# EasyEDA Pro project OURphone_PCB_2026-01-30.epro, board 1-PCB_PCB_OURS PHONE_CONNECTORS_FLIP_2
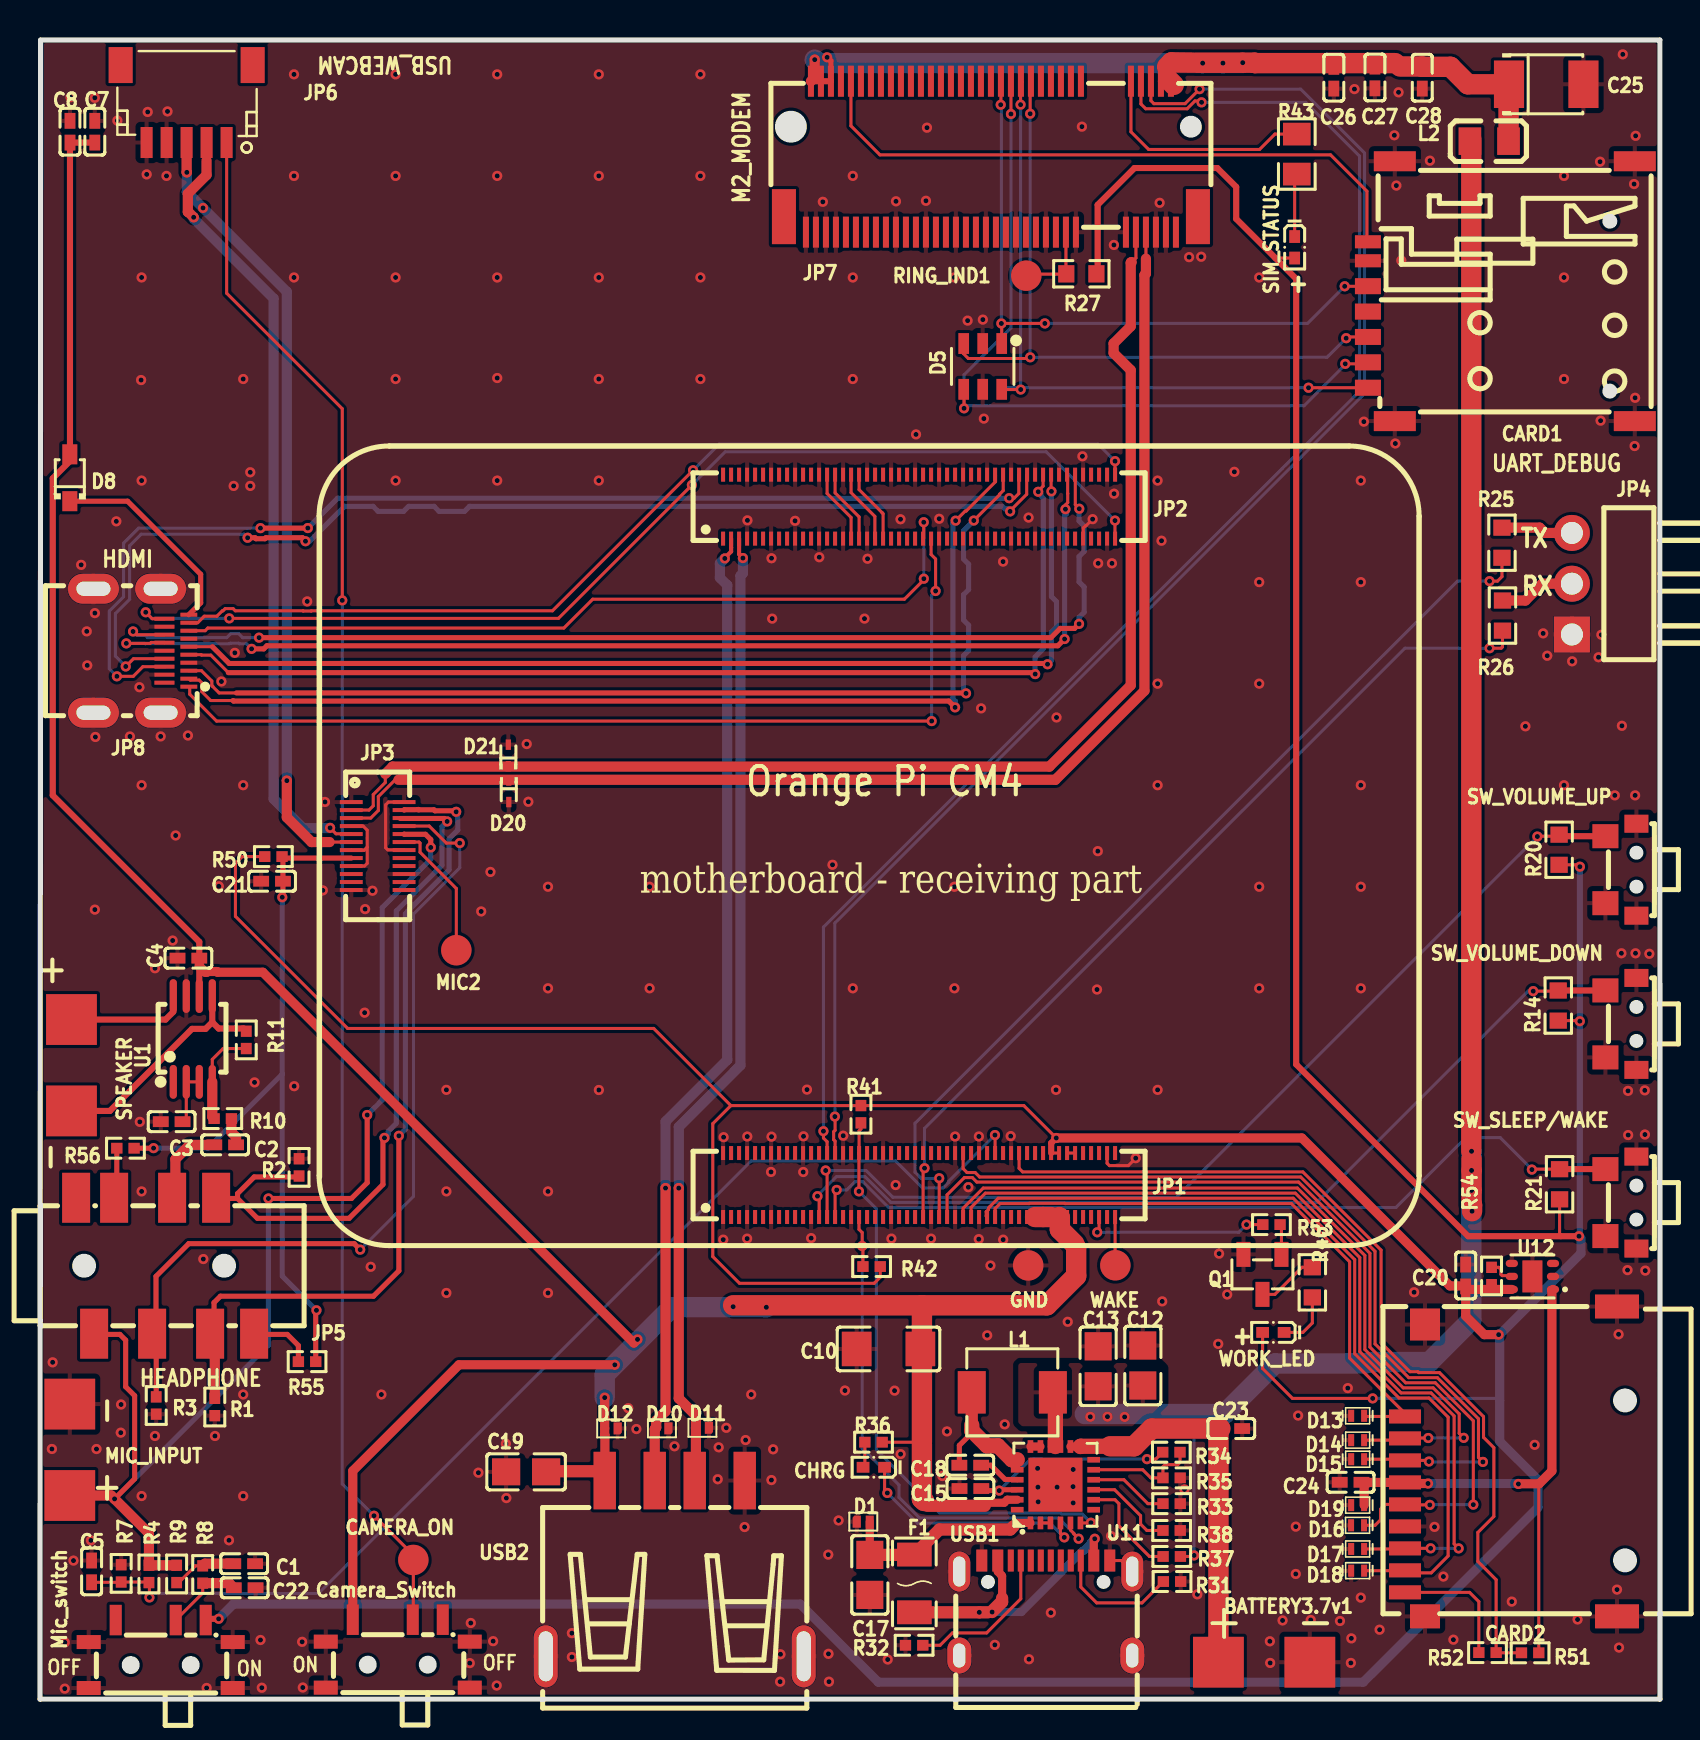
[diagram p8: board, top side]
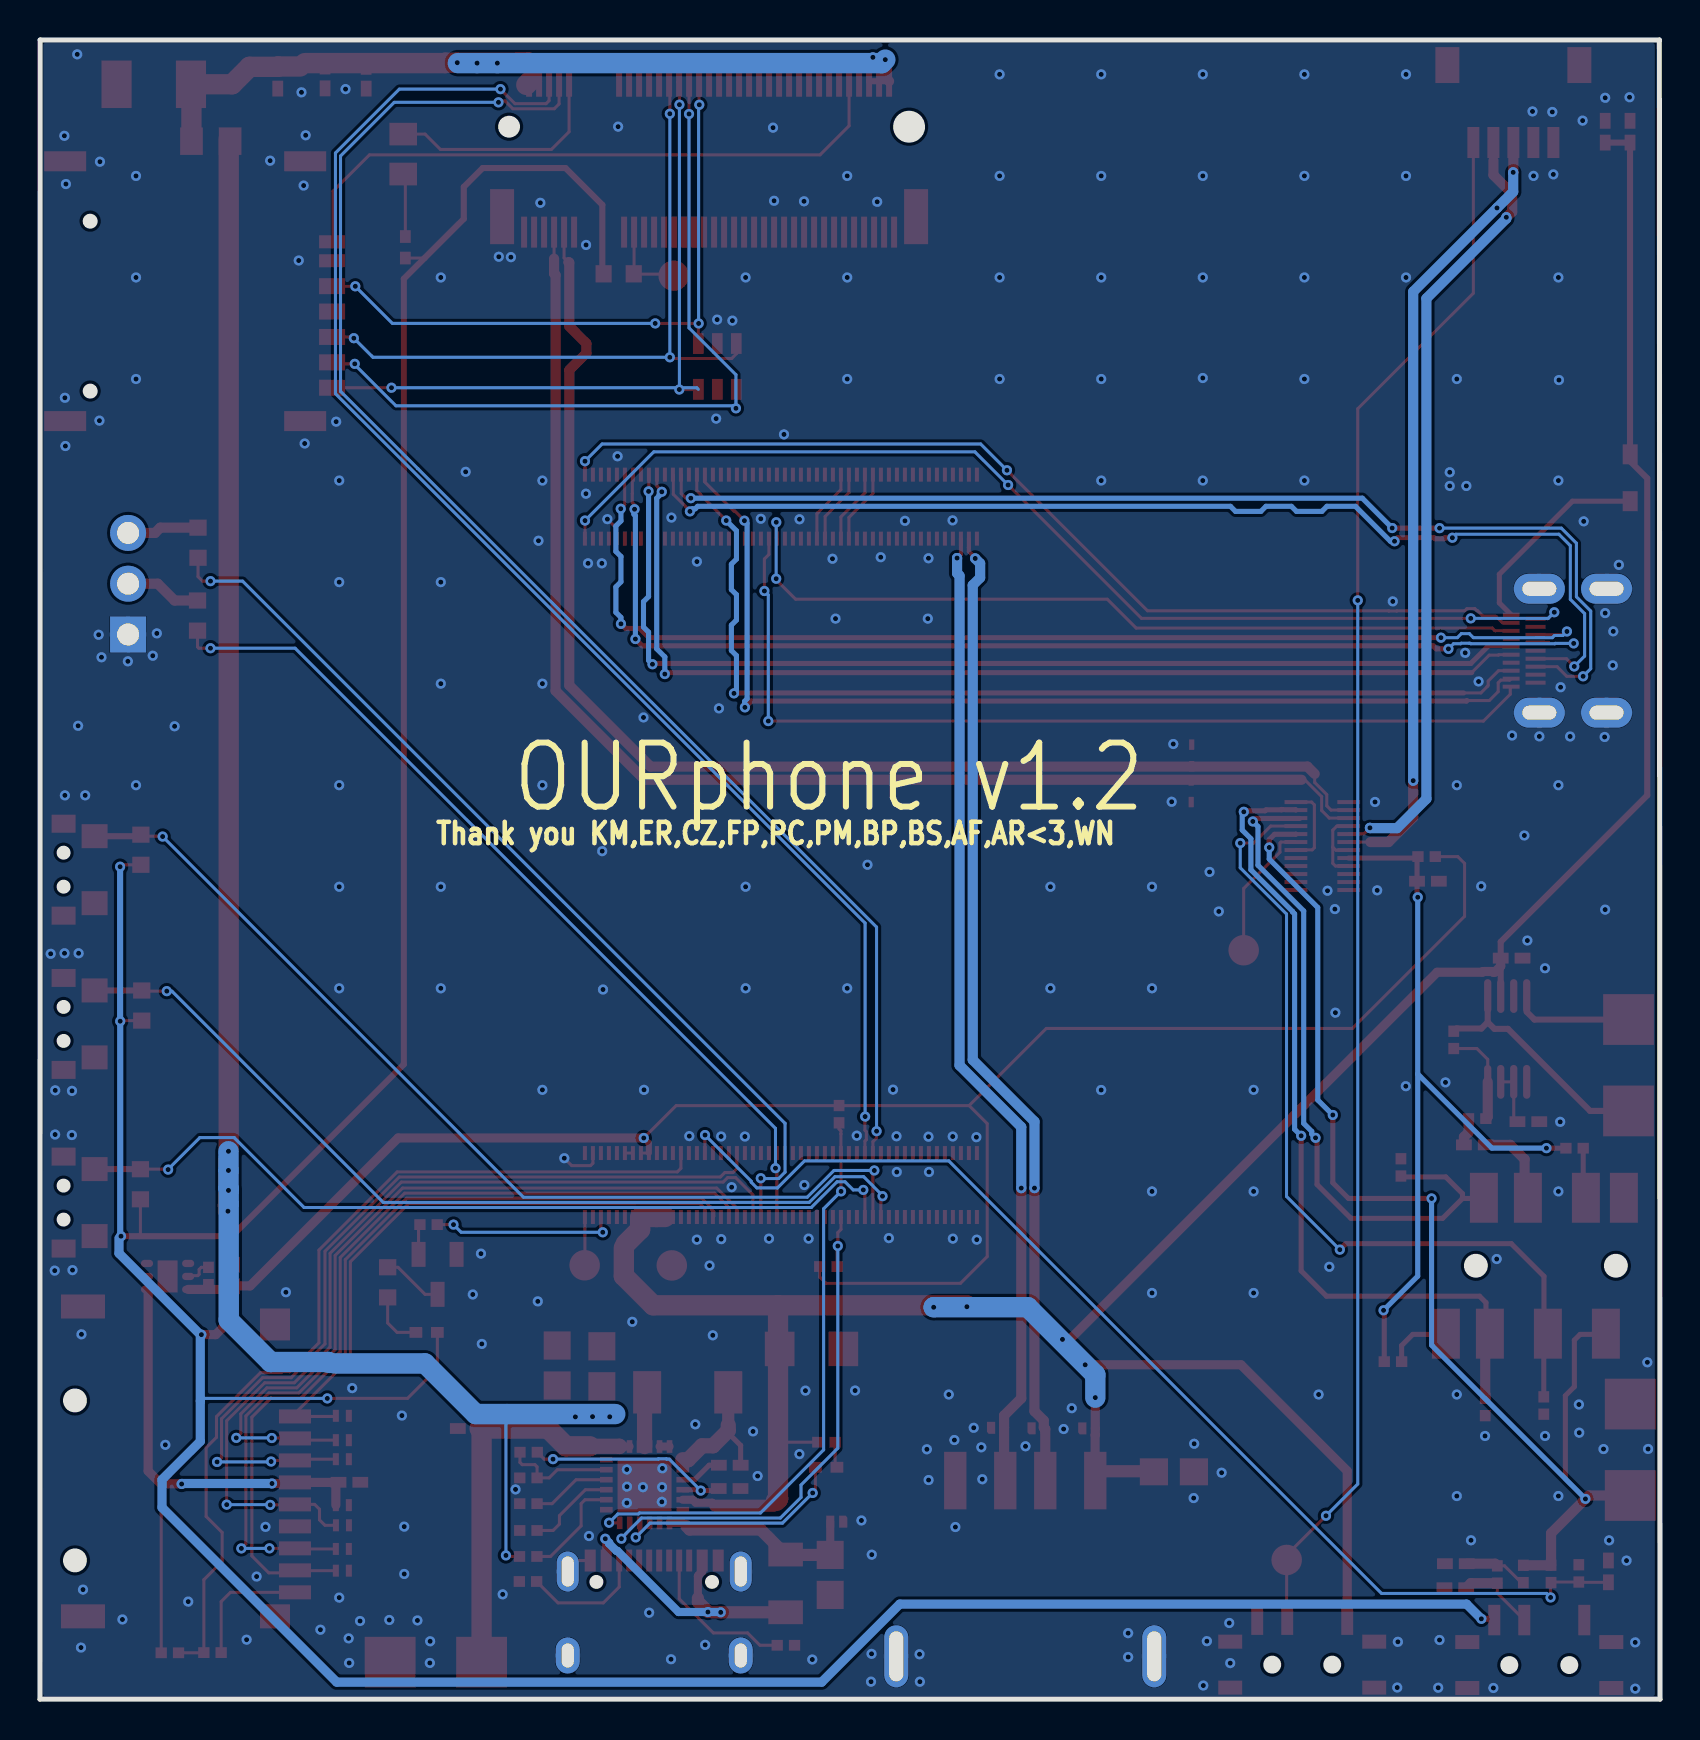
[diagram p9: board, bottom side, seen from below]

Outline 81 x 83 mm; copper layers: Top Layer, Bottom Layer. Coordinates in mm from the lower left corner of the outline.
Outline path: 0,0 0.03,83 80.99,83 81,0 0,0
Stack: Top Layer 0.035mm / Dielectric1 1.51mm FR4 er 4.5 / Bottom Layer 0.035mm

## Design rules (mm)
net USB2_HOST2_P: DP6
net USB2_HOST2_N: DP6
net HDMI_TX2_P: DP4
net HDMI_TX2_N: DP4
net HDMI_TX1_P: DP3
net HDMI_TX1_N: DP3
net HDMI_TX0_P: DP1
net HDMI_TX0_N: DP1
net HDMI_TXCLK_P: DP2
net HDMI_TXCLK_N: DP2
net MIPI_CSI_RX_D2N: MIPI_CSI_RX_D2
net MIPI_CSI_RX_D2P: MIPI_CSI_RX_D2
net MIPI_CSI_RX_D3N: MIPI_CSI_RX_D3
net MIPI_CSI_RX_D3P: MIPI_CSI_RX_D3
net USB2_0_OTG_DM: DP8
net USB2_0_OTG_DP: DP8
template: User Custom Config
spacing Default (default): track to track 0.102, other pairs 0 to 0.152
track width Default (default): min 0.051, default 0.152, max 1.27
differential pair Default (default): width min 0.152, default 0.508, max 0.762; gap min 0.152, default 0.152
via Default (default): diameter min 0.178, default 0.762, max 100.025; hole min 0.15, default 0.61, max 59.995
pour e4504 uses copperRegion1

## Placement (name value [footprint] x y rotation side)
BATTERY3.7v1  NOB  [BATTERY SYMBOL]  64.76 0.71 0 top
C1  10uF  [C0402]  10.21 6.78 180 top
C2  390nF  [C0402]  9.26 27.73 0 top
C3  1uF  [C0402]  6.58 28.89 0 top
C4  1uF  [C0402]  7.42 37.07 0 top
C5  100nF  [C0402]  2.58 6.39 270 top
C7  100nF  [C0402]  2.74 78.41 90 top
C8  10uF  [C0402]  1.5 78.41 270 top
C10  100uF  [C1206]  42.43 17.52 0 top
C12  22uF  [C0805]  55.14 16.69 270 top
C13  22uF  [C0805]  52.91 16.65 270 top
C15  10uF  [C0402]  46.52 10.54 0 top
C17  2.2uF  [C0805]  41.49 6.22 90 top
C18  100nF  [C0402]  46.51 11.7 0 top
C19  2.2uF  [C0805]  24.31 11.37 0 top
C20  1uF  [C0402]  71.28 21.19 270 top
C21  100nF  [C0402]  11.6 40.92 0 top
C22  10uF  [C0402]  10.23 5.57 180 top
C23  100nF  [C0402]  59.56 13.54 180 top
C24  1uF  [C0402]  65.53 10.85 0 top
C25  100uF  [CASE-B_3528]  75.31 80.78 0 top
C26  100nF  [C0402]  64.69 81.11 270 top
C27  10uF  [C0402]  66.75 81.12 90 top
C28  33pF  [C0402]  69.11 81.11 90 top
CAMERA_ON  TP-橘色测试点  [TESTPOINT-TH_BD3.2]  18.67 6.96 180 top
Camera_Switch  HX MSK12C02-HB  [SW-SMD_MSK12C02-HB]  17.89 2.28 0 top
CARD1  SMN-303  [SIM-SMD_SMN-303]  73.07 70.43 90 top
CARD2  XKTF-N02-N  [TF-SMD_XKTF-N02-N]  73.55 11.89 90 top
CHRG  XL-1005UGC  [LED0402-RD_GREEN]  41.69 11.6 180 top
D1  AZ5825-01F  [DFN-2L_L1.0-W0.6-P0.65-BI]  41.16 8.88 0 top
D5  DT1042-04SO-7  [SOT-26_L3.0-W1.6-P0.95-LS2.8-BL]  47.14 66.67 180 top
D8  1N5819WS  [SOD-323_L1.8-W1.3-LS2.5-RD]  1.49 61.1 90 top
D10  AZ5825-01F  [DFN-2L_L1.0-W0.6-P0.65-BI]  31.1 13.55 180 top
D11  AZ5825-01F  [DFN-2L_L1.0-W0.6-P0.65-BI]  33.12 13.57 180 top
D12  AZ5825-01F  [DFN-2L_L1.0-W0.6-P0.65-BI]  28.56 13.54 180 top
D13  LESD8D3.3CAT5G  [SOD-882_L1.0-W0.6-BI]  65.88 14.18 180 top
D14  LESD8D3.3CAT5G  [SOD-882_L1.0-W0.6-BI]  65.88 12.96 180 top
D15  LESD8D3.3CAT5G  [SOD-882_L1.0-W0.6-BI]  65.88 12 180 top
D16  LESD8D3.3CAT5G  [SOD-882_L1.0-W0.6-BI]  65.88 8.7 180 top
D17  LESD8D3.3CAT5G  [SOD-882_L1.0-W0.6-BI]  65.88 7.51 180 top
D18  LESD8D3.3CAT5G  [SOD-882_L1.0-W0.6-BI]  65.88 6.43 180 top
D19  LESD8D3.3CAT5G  [SOD-882_L1.0-W0.6-BI]  65.88 9.71 0 top
D20  ESD9M5.0ST5G  [SOD-923_L0.8-W0.6-LS1.0-RD]  23.44 45.42 270 top
D21  ESD9M5.0ST5G  [SOD-923_L0.8-W0.6-LS1.0-RD]  23.42 47.21 90 top
F1  SMD1206P250TF  [F1206]  43.72 5.79 90 top
GND  TP-橘色测试点  [TESTPOINT-TH_BD3.2]  49.41 21.7 0 top
JP1  DF40C-100DS-0.4V(51)  [CONN-SMD_DF40C-100DS-0.4V-51]  43.95 25.72 180 top
JP2  DF40C-100DS-0.4V(51)  [CONN-SMD_DF40C-100DS-0.4V-51]  43.95 59.66 180 top
JP3  DF40C-24DS-0.4V(51)  [CONN-SMD_DF40C-24DS-0.4V51]  16.88 42.68 90 top
JP4  PZ254R-11-03P  [HDR-TH_3P-P2.54-H-M-W10.4]  76.59 55.8 90 top
JP5  PJ-393-8P  [AUDIO-TH_PJ-393-8P]  6.26 21.68 0 top
JP6  SM05B-SRSS-TB (LF)(SN)  [CONN-SMD_SM05B-SRSS-TB-LF-SN]  7.33 79.81 180 top
JP7  AS0BC21-S30BB-7H  [CONN-SMD_AS0BC21-S30BB-7H]  47.55 77.16 180 top
JP8  HDMI-101S  [HDMI-SMD_HDMI-101S]  5.06 52.45 270 top
L1  2.2uH  [IND-SMD_L4.4-W4.2]  48.62 15.35 180 top
L2  BLM21PG300SN1D  [L0805]  72.46 77.94 0 top
MIC2  TP-橘色测试点  [TESTPOINT-TH_BD3.2]  20.82 37.47 0 top
MIC_INPUT  NOB  [BATTERY SYMBOL]  2.63 16.03 90 top
Mic_switch  HX MSK12C02-HB  [SW-SMD_MSK12C02-HB]  6.03 2.26 0 top
Q1  AO3400  [SOT-23-3_L2.9-W1.3-P1.90-LS2.4-BR]  61.12 21.25 90 top
R1  470Ω  [R0402]  8.74 14.62 90 top
R2  470Ω  [R0402]  12.95 26.6 270 top
R3  0Ω  [R0402]  5.81 14.69 90 top
R4  100kΩ  [R0402]  5.45 6.26 270 top
R7  100kΩ  [R0402]  4.06 6.29 270 top
R8  22Ω  [R0402]  8.14 6.24 270 top
R9  2.2kΩ  [R0402]  6.83 6.26 270 top
R10  20kΩ  [R0402]  9.14 29.04 180 top
R11  20kΩ  [R0402]  10.31 32.98 270 top
R14  10K  [R0603]  75.91 34.7 90 top
R20  10K  [R0603]  75.96 42.49 90 top
R21  10K  [R0603]  75.98 25.76 90 top
R25  1kΩ  [R0603]  73.1 57.85 90 top
R26  1kΩ  [R0603]  73.12 54.21 90 top
R27  10K  [R0603]  52.07 71.3 180 top
R31  5.1kΩ  [R0402]  56.6 5.88 180 top
R32  5.1kΩ  [R0402]  43.71 2.69 0 top
R33  270Ω  [R0402]  56.58 9.78 180 top
R34  10kΩ  [R0402]  56.57 12.35 180 top
R35  10kΩ  [R0402]  56.58 11.07 180 top
R36  2.2kΩ  [R0402]  41.68 12.85 0 top
R37  10kΩ  [R0402]  56.59 7.14 180 top
R38  100kΩ  [R0402]  56.58 8.44 0 top
R41  10kΩ  [R0402]  41.05 29.26 90 top
R42  10kΩ  [R0402]  41.58 21.64 0 top
R43  330Ω  [R0805]  62.84 77.29 270 top
R46  1kΩ  [R0603]  63.62 20.85 270 top
R50  100kΩ  [R0402]  11.67 42.15 0 top
R51  1kΩ  [R0402]  74.51 2.32 0 top
R52  200Ω  [R0402]  72.38 2.33 180 top
R53  200Ω  [R0402]  61.57 23.74 180 top
R54  47kΩ  [R0402]  72.58 21.17 270 top
R55  5.1kΩ  [R0402]  13.35 16.88 180 top
R56  0Ω  [R0402]  4.27 27.56 180 top
RING_IND1  TP-橘色测试点  [TESTPOINT-TH_BD3.2]  49.31 71.21 180 top
SIM_STATUS  XL-1005UBC  [LED0402-RD]  62.73 72.63 270 top
SPEAKER  NOB  [BATTERY SYMBOL]  0.43 28.16 270 top
SW_SLEEP/WAKE  TS24CA  [SW-SMD_TS24CA]  79.05 24.84 270 top
SW_VOLUME_DOWN  TS24CA  [SW-SMD_TS24CA]  79.05 33.78 270 top
SW_VOLUME_UP  TS24CA  [SW-SMD_TS24CA]  79.05 41.49 270 top
U1  LM4990MM/NOPB  [MSOP-8_L3.0-W3.0-P0.65-LS5.0-BL]  7.64 33.03 0 top
U11  BQ25895RTWR  [QFN-24_L4.0-W4.0-P0.50-TL-EP2.7]  50.77 10.73 90 top
U12  TPS25961DRVR  [WSON-6_L2.0-W2.0-P0.65-TL-EP]  74.62 21.15 180 top
USB1  TYPE-C 16PIN 2MD(073)  [USB-C-SMD_TYPE-C-6PIN-2MD-073]  50.29 4.56 0 top
USB2  10.0 QHHTZB6.3  [USB-A-TH_10.0QHHTZB6.3]  31.74 6.54 0 top
WAKE  TP-橘色测试点  [TESTPOINT-TH_BD3.2]  53.77 21.7 0 top
WORK_LED  XL-1005UBC  [LED0402-RD]  61.67 18.35 180 top

## Footprints (pads in the part's own frame, mm; a bottom-side part is the same pattern mirrored in y, then rotated)
AUDIO-TH_PJ-393-8P
  rect 1.4x2.5 smd: 1(-3.55,-3.4) 2(-0.65,-3.4) 3(2.25,-3.4) 4(2.55,3.4) 5(-4.45,3.4) 6(-2.55,3.4) 7(0.35,3.4) 8(4.45,-3.4)
BATTERY SYMBOL
  rect 2.54x2.54 smd: 1(-5.842,1.143) 2(-1.27,1.143)
C0402
  rect 0.79x0.54 smd: 1(-0.545,0) 2(0.545,0)
C0805
  rect 1.41x1.35 smd: 1(-1,0) 2(1,0)
C1206
  rect 1.485x1.728 smd: 1(-1.593,0) 2(1.593,0)
CASE-B_3528
  rect 1.506x2.376 smd: 1(-1.861,0) 2(1.861,0)
CONN-SMD_AS0BC21-S30BB-7H
  rect 0.3x1.55 smd: 1(-9.25,3.775) 2(-9,-3.775) 3(-8.75,3.775) 4(-8.5,-3.775) 5(-8.25,3.775) 6(-8,-3.775) 7(-7.75,3.775) 8(-7.5,-3.775) 9(-7.25,3.775) 10(-7,-3.775) 11(-6.75,3.775) 20(-4.5,-3.775) 21(-4.25,3.775) 22(-4,-3.775) 23(-3.75,3.775) 24(-3.5,-3.775) 25(-3.25,3.775) 26(-3,-3.775) 27(-2.75,3.775) 28(-2.5,-3.775) 29(-2.25,3.775) 30(-2,-3.775) 31(-1.75,3.775) 32(-1.5,-3.775) 33(-1.25,3.775) 34(-1,-3.775) 35(-0.75,3.775) 36(-0.5,-3.775) 37(-0.25,3.775) 38(0,-3.775) 39(0.25,3.775) 40(0.5,-3.775) 41(0.75,3.775) 42(1,-3.775) 43(1.25,3.775) 44(1.5,-3.775) 45(1.75,3.775) 46(2,-3.775) 47(2.25,3.775) 48(2.5,-3.775) 49(2.75,3.775) 50(3,-3.775) 51(3.25,3.775) 52(3.5,-3.775) 53(3.75,3.775) 54(4,-3.775) 55(4.25,3.775) 56(4.5,-3.775) 57(4.75,3.775) 58(5,-3.775) 59(5.25,3.775) 60(5.5,-3.775) 61(5.75,3.775) 62(6,-3.775) 63(6.25,3.775) 64(6.5,-3.775) 65(6.75,3.775) 66(7,-3.775) 67(7.25,3.775) 68(7.5,-3.775) 69(7.75,3.775) 70(8,-3.775) 71(8.25,3.775) 72(8.5,-3.775) 73(8.75,3.775) 74(9,-3.775) 75(9.25,3.775)
  rect 1.2x2.75 smd: 76(10.35,3) 77(-10.35,3)
CONN-SMD_DF40C-24DS-0.4V51
  rect 0.2x1.14 smd: 1(2.2,1.32) 2(2.2,-1.32) 3(1.8,1.32) 4(1.8,-1.32) 5(1.4,1.32) 6(1.4,-1.32) 7(1,1.32) 8(1,-1.32) 9(0.6,1.32) 10(0.6,-1.32) 11(0.2,1.32) 12(0.2,-1.32) 13(-0.2,1.32) 14(-0.2,-1.32) 15(-0.6,1.32) 16(-0.6,-1.32) 17(-1,1.32) 18(-1,-1.32) 19(-1.4,1.32) 20(-1.4,-1.32) 21(-1.8,1.32) 22(-1.8,-1.32) 23(-2.2,1.32) 24(-2.2,-1.32)
CONN-SMD_DF40C-100DS-0.4V-51
  rect 0.2x0.7 smd: 1(9.8,1.6) 2(9.8,-1.6) 3(9.4,1.6) 4(9.4,-1.6) 5(9,1.6) 6(9,-1.6) 7(8.6,1.6) 8(8.6,-1.6) 9(8.2,1.6) 10(8.2,-1.6) 11(7.8,1.6) 12(7.8,-1.6) 13(7.4,1.6) 14(7.4,-1.6) 15(7,1.6) 16(7,-1.6) 17(6.6,1.6) 18(6.6,-1.6) 19(6.2,1.6) 20(6.2,-1.6) 21(5.8,1.6) 22(5.8,-1.6) 23(5.4,1.6) 24(5.4,-1.6) 25(5,1.6) 26(5,-1.6) 27(4.6,1.6) 28(4.6,-1.6) 29(4.2,1.6) 30(4.2,-1.6) 31(3.8,1.6) 32(3.8,-1.6) 33(3.4,1.6) 34(3.4,-1.6) 35(3,1.6) 36(3,-1.6) 37(2.6,1.6) 38(2.6,-1.6) 39(2.2,1.6) 40(2.2,-1.6) 41(1.8,1.6) 42(1.8,-1.6) 43(1.4,1.6) 44(1.4,-1.6) 45(1,1.6) 46(1,-1.6) 47(0.6,1.6) 48(0.6,-1.6) 49(0.2,1.6) 50(0.2,-1.6) 51(-0.2,1.6) 52(-0.2,-1.6) 53(-0.6,1.6) 54(-0.6,-1.6) 55(-1,1.6) 56(-1,-1.6) 57(-1.4,1.6) 58(-1.4,-1.6) 59(-1.8,1.6) 60(-1.8,-1.6) 61(-2.2,1.6) 62(-2.2,-1.6) 63(-2.6,1.6) 64(-2.6,-1.6) 65(-3,1.6) 66(-3,-1.6) 67(-3.4,1.6) 68(-3.4,-1.6) 69(-3.8,1.6) 70(-3.8,-1.6) 71(-4.2,1.6) 72(-4.2,-1.6) 73(-4.6,1.6) 74(-4.6,-1.6) 75(-5,1.6) 76(-5,-1.6) 77(-5.4,1.6) 78(-5.4,-1.6) 79(-5.8,1.6) 80(-5.8,-1.6) 81(-6.2,1.6) 82(-6.2,-1.6) 83(-6.6,1.6) 84(-6.6,-1.6) 85(-7,1.6) 86(-7,-1.6) 87(-7.4,1.6) 88(-7.4,-1.6) 89(-7.8,1.6) 90(-7.8,-1.6) 91(-8.2,1.6) 92(-8.2,-1.6) 93(-8.6,1.6) 94(-8.6,-1.6) 95(-9,1.6) 96(-9,-1.6) 97(-9.4,1.6) 98(-9.4,-1.6) 99(-9.8,1.6) 100(-9.8,-1.6)
CONN-SMD_SM05B-SRSS-TB-LF-SN
  rect 0.6x1.55 smd: 1(-2,1.938) 2(-0.999,1.938) 3(0.001,1.938) 4(1,1.938) 5(2.001,1.938)
  rect 1.2x1.8 smd: 6(-3.3,-1.938) 7(3.3,-1.938)
DFN-2L_L1.0-W0.6-P0.65-BI
  custom 0.41x0.6 smd: 1(-0.325,0)
  rect 0.4x0.6 smd: 2(0.325,0)
F1206
  rect 1.19x1.728 smd: 1(-1.445,0) 2(1.445,0)
HDMI-SMD_HDMI-101S
  rect 0.2x0.84 smd: 1(1.8,2.385) 3(1.4,2.385) 5(1,2.385) 7(0.6,2.385) 9(0.2,2.385) 11(-0.2,2.385) 13(-0.6,2.385) 15(-1,2.385) 17(-1.4,2.385) 19(-1.8,2.385)
  rect 0.2x1 smd: 2(1.6,1.165) 4(1.2,1.165) 6(0.8,1.165) 8(0.4,1.165) 10(0,1.165) 12(-0.4,1.165) 14(-0.8,1.165) 16(-1.2,1.165) 18(-1.6,1.165)
  oval 1.5x2.55 hole 0.7x1.7: 20(-3.1,0.975) 20(-3.1,-2.385) 20(3.1,0.975) 20(3.1,-2.385)
HDR-TH_3P-P2.54-H-M-W10.4
  rect 1.8x1.8 hole 1.1: 1(-2.54,0)
  round 1.8 hole 1.1: 2(0,0) 3(2.54,0)
IND-SMD_L4.4-W4.2
  rect 1.4x2.12 smd: 1(2.028,0) 2(-2.028,0)
L0805
  rect 1.133x1.377 smd: 1(-0.966,0) 2(0.966,0)
LED0402-RD
  rect 0.636x0.54 smd: 1(-0.538,0) 2(0.538,0)
LED0402-RD_GREEN
  rect 0.636x0.54 smd: 1(-0.538,0) 2(0.538,0)
MSOP-8_L3.0-W3.0-P0.65-LS5.0-BL
  oval 0.364x1.692 smd: 1(-0.975,-2.146) 2(-0.325,-2.146) 3(0.325,-2.146) 4(0.975,-2.146) 5(0.975,2.146) 6(0.325,2.146) 7(-0.325,2.146) 8(-0.975,2.146)
QFN-24_L4.0-W4.0-P0.50-TL-EP2.7
  rect 0.633x0.28 smd: 1(-1.911,1.25) 2(-1.911,0.75) 3(-1.911,0.25) 4(-1.911,-0.25) 5(-1.911,-0.75) 6(-1.911,-1.25) 13(1.911,-1.25) 14(1.911,-0.75) 15(1.911,-0.25) 16(1.911,0.25) 17(1.911,0.75) 18(1.911,1.25)
  rect 0.28x0.633 smd: 7(-1.25,-1.911) 8(-0.75,-1.911) 9(-0.25,-1.911) 10(0.25,-1.911) 11(0.75,-1.911) 12(1.25,-1.911) 19(1.25,1.911) 20(0.75,1.911) 21(0.25,1.911) 22(-0.25,1.911) 23(-0.75,1.911) 24(-1.25,1.911)
  rect 2.7x2.7 smd: 25(0,0)
R0402
  rect 0.566x0.54 smd: 1(-0.433,0) 2(0.433,0)
R0603
  rect 0.806x0.864 smd: 1(-0.753,0) 2(0.753,0)
R0805
  rect 1.133x1.377 smd: 1(-1,0) 2(1,0)
SIM-SMD_SMN-303
  rect 1x2.1 smd: 8(-6.5,5.328) 9(6.5,5.328) 10(6.5,-6.672) 11(-6.5,-6.672)
  rect 0.8x1.3 smd: C1(0.25,6.672) C2(-2.29,6.672) C3(-4.83,6.672) C6(-1.02,6.672) C7(-3.56,6.672)
  rect 0.65x1.3 smd: C5(1.52,6.672) CD(2.47,6.672)
SOD-323_L1.8-W1.3-LS2.5-RD
  rect 1x0.75 smd: 1(-1.173,0) 2(1.173,0)
SOD-882_L1.0-W0.6-BI
  rect 0.3x0.6 smd: 1(-0.325,0) 2(0.325,0)
SOD-923_L0.8-W0.6-LS1.0-RD
  rect 0.52x0.26 smd: 1(-0.54,0) 2(0.54,0)
SOT-23-3_L2.9-W1.3-P1.90-LS2.4-BR
  rect 1.25x0.7 smd: 1(1,-0.95) 2(1,0.95) 3(-1,0)
SOT-26_L3.0-W1.6-P0.95-LS2.8-BL
  rect 0.532x1.04 smd: 1(-0.95,-1.145) 2(0,-1.145) 3(0.95,-1.145) 4(0.95,1.145) 5(0,1.145) 6(-0.95,1.145)
SW-SMD_MSK12C02-HB
  rect 0.6x1.524 smd: 1(-2.25,1.7) 2(0.75,1.7) 3(2.25,1.7)
  rect 1.2x0.7 smd: 4(-3.6,0.6) 4(-3.6,-1.7) 4(3.6,0.6) 4(3.6,-1.7)
SW-SMD_TS24CA
  rect 0.9x1.2 smd: 1(-2.3,0.775) 2(2.3,0.775)
  rect 1.2x1.3 smd: 3(-1.675,-0.775) 4(1.675,-0.775)
TESTPOINT-TH_BD3.2
  round 1.524 smd: 1(0,0)
TF-SMD_XKTF-N02-N
  rect 0.7x1.6 smd: 1(2.25,5.3) 2(1.15,5.3) 3(0.05,5.3) 4(-1.05,5.3) 5(-2.15,5.3) 6(-3.25,5.3) 7(-4.35,5.3) 8(-5.45,5.3) 9(-6.55,5.3)
  rect 1.2x1.5 smd: 10(-7.75,4.3)
  rect 1.2x2.2 smd: 11(-7.75,-5.3) 13(7.75,-5.3)
  rect 1.6x1.5 smd: 12(6.85,4.3)
USB-A-TH_10.0QHHTZB6.3
  rect 1.12x2.88 smd: 1(-3.5,4.395) 2(-1,4.395) 3(1,4.395) 4(3.5,4.395)
  oval 1.2x3.1 hole 0.7x2.5: 5(-6.45,-4.395) 6(6.45,-4.395)
USB-C-SMD_TYPE-C-6PIN-2MD-073
  rect 0.55x1.1 smd: 1(-3.2,2.375) 2(-2.4,2.375) 11(2.4,2.375) 12(3.2,2.375)
  rect 0.3x1.1 smd: 3(-1.75,2.375) 4(-1.25,2.375) 5(-0.75,2.375) 6(-0.25,2.375) 7(0.25,2.375) 8(0.75,2.375) 9(1.25,2.375) 10(1.75,2.375)
  oval 1.1x2 hole 0.6x1.5: 13(-4.325,1.825) 14(4.325,1.825)
  oval 1.2x1.8 hole 0.6x1.2: 13(-4.325,-2.375) 14(4.325,-2.375)
WSON-6_L2.0-W2.0-P0.65-TL-EP
  oval 0.607x0.364 smd: 1(-1.028,0.65) 2(-1.028,0) 3(-1.028,-0.65) 4(1.028,-0.65) 5(1.028,0) 6(1.028,0.65)
  rect 1x1.6 smd: 7(0,0)

## Nets
As in the schematic.

Pads without a net: Camera_Switch 3; CARD1 C6; JP1 3 4 5 6 9 10 11 12 15 16 17 18 19 20 21 24 26 31 34 37 38 39 40 41 44 45 46 47 48 49 50 54 56 58 64 68 72 73 75 78 80 82 89 91 92 93 94 96 97 100; JP2 1 2 4 6 9 10 11 12 15 16 17 18 21 22 23 24 27 29 40 42 43 45 46 47 48 49 52 54 57 58 59 60 63 64 65 66 69 71 75 77 81 83 87 89 93 94 95 96; JP3 16 18 19 21 22 24; JP5 5; JP6 6 7; JP7 1 20 22 24 25 26 28 29 31 35 37 38 40 41 42 43 44 46 47 48 49 50 52 53 54 55 56 58 59 60 61 62 63 64 65 67 68 76 77; JP8 2; Mic_switch 1; U1 1; U11 7 12 24; U12 3; USB1 3 5 6 7 8 9

## Via types
v1: diameter 0.508, hole 0.254, Top Layer to Bottom Layer, 429 vias

## Routing (per net, layer and track width the routed paths; a pad name or vN(x,y) marks a point on that pad's centre or on a via; arc(x,y) is an arc through that point)
+5V: length 156.6
  Top Layer w0.152: 42.11,12.85 44.2,12.85 44.32,12.74 ; JP1.87 JP1.85
  Top Layer w0.305: 1.5,62.44 C8.2 C7.1 ; D8.2 1.49,61.92 0.64,61.07 0.64,45.21 7.96,37.89 C4.2 ; 1.41,62.35 1.34,62.28 ; U1.6 7.96,36.67
  Top Layer w0.406: U11.23 48.36,9.98 48.21,9.83 47.39,9.83 47.24,9.67
  Top Layer w0.457: C4.2 7.96,36.67 8.27,36.36 8.34,36.36 8.38,36.4 8.85,36.4 8.88,36.36 11.14,36.36 29.69,17.81 v1(29.88,18) ; Camera_Switch.1 15.64,11.42 20.95,16.73 v1(28.74,16.73) ; USB2.1 28.24,10.94 28.24,13.2 28.24,13.21 D12.2 v1(28.24,15.09)
  Top Layer w0.61: USB2.1 28.24,11.37 28.21,11.4 25.38,11.4 25.35,11.37 C19.2 ; 47.24,9.67 44.36,9.67
  Top Layer w1.016: 44.1,19.7 50.34,19.7 51.81,21.17 51.81,22.58 ; 44.1,19.7 34.66,19.7 ; 44.1,19.7 44.1,12.85 ; JP1.83 JP1.81 JP1.79 ; 44.2,9.91 44.1,10.02 44.1,12.74 ; 51.71,22.78 50.99,23.5 50.99,24.08 JP1.85
  Bottom Layer w1.016: v1(28.24,15.09) 28.24,16.23 31.61,19.61 36.31,19.61 v1(36.32,19.6)
  vias: v1(34.66,19.63)
GND: length 13.7
  Top Layer w0.152: 16.36,42.63 16.36,43.47 16.16,43.68 JP3.7 ; 16.36,42.63 16.2,42.46 15.58,42.46 JP3.13 ; 16.36,42.63 16.36,41.81 16.23,41.68 JP3.17 ; JP2.91 52.17,58.07 52.17,58.59 52.27,58.7 52.3,58.7 v1(52.63,59.03) ; USB1.14 54.06,6.93 USB1.12 ; v1(54.79,27.06) 54.41,26.69 53.47,26.69 53.35,26.81 53.35,27.32 ; JP3.2 17.42,44.88 17.28,44.74 17.28,42.59 17.39,42.49 18.19,42.49 JP3.14
  Top Layer w0.305: 78.26,23.16 SW_SLEEP/WAKE.4 ; SW_VOLUME_UP.4 78.26,39.83 ; 78.18,32.02 SW_VOLUME_DOWN.4
  Top Layer w0.406: U11.17 U11.18
  vias: v1(0.63,16.85) v1(0.6,12.51) v1(1.24,2.84) v1(1.24,0.53) v1(1.52,80.14) v1(1.67,6.93) v1(2.06,56.74) v1(2.34,53.42) v1(2.36,51.71) v1(2.55,7.94) v1(2.74,80.11) v1(2.74,54.33) v1(2.74,39.5) v1(2.77,48.13) v1(2.82,12.51) v1(3.82,58.92) v1(3.87,78.97) v1(4.04,13.33) v1(4.05,14.74) v1(4.5,48.16) v1(4.97,50.62) v1(4.99,28.88) v1(5.08,71.12) v1(5.05,65.99) v1(5.08,60.96) v1(5.08,45.72) v1(5.08,25.4) v1(5.08,10.16) v1(5.33,76.28) v1(5.39,79.4) v1(5.75,13.16) v1(5.75,36.56) v1(6.03,48.16) v1(6.32,76.2) v1(6.38,79.43) v1(6.63,37.95) v1(6.78,43.21) v1(7.4,48.21) v1(8.17,22.02) v1(8.33,0.56) v1(8.75,13.16) v1(8.94,40.67) v1(9.07,50.91) v1(9.45,7.95) v1(9.68,60.69) v1(9.74,52.34) v1(10.16,66.04) v1(10.16,45.72) v1(10.16,15.24) v1(10.16,10.16) v1(10.51,61.38) v1(10.51,60.69) v1(10.73,30.85) v1(11.02,2.96) v1(11.09,0.57) v1(12.7,81.28) v1(12.7,76.2) v1(12.7,71.12) v1(12.71,30.66) v1(13.11,2.87) v1(13.14,0.58) v1(13.36,54.92) v1(14.14,40.46) v1(14.25,44.88) v1(16.23,34.34) v1(16.26,39.52) v1(16.54,21.63) v1(16.62,40.44) v1(17.07,15.24) v1(17.78,81.28) v1(17.78,76.2) v1(17.78,71.12) v1(17.78,66.04) v1(17.78,60.96) v1(20.32,30.48) v1(20.32,25.4) v1(20.32,20.32) v1(21.54,3.81) v1(21.49,1.8) v1(21.92,11.33) v1(22.06,39.41) v1(22.52,41.38) v1(22.66,2.9) v1(22.83,0.68) v1(22.86,81.28) v1(22.86,76.2) v1(22.86,71.12) v1(22.86,66.09) v1(22.86,60.96) v1(23.29,12.78) v1(23.32,10.06) v1(24.34,47.78) v1(24.42,44.89) v1(25.4,40.64) v1(25.4,35.56) v1(25.4,25.4) v1(25.4,20.32) v1(26.59,3.3) v1(26.59,2.11) v1(27.94,81.28) v1(27.94,76.2) v1(27.94,71.12) v1(27.94,66.04) v1(27.94,60.96) v1(27.94,30.47) v1(29.41,14.55) v1(29.82,13.51) v1(30.48,40.64) v1(30.48,35.56) v1(31.72,12.65) v1(33.02,81.28) v1(33.02,76.2) v1(33.02,71.12) v1(33.02,66.04) v1(33.93,12.6) v1(33.89,11) v1(34.18,28.11) v1(34.16,22.99) v1(34.31,13.57) v1(35.23,8.61) v1(35.28,12.96) v1(35.37,58.97) v1(35.36,28.15) v1(35.36,23.04) v1(35.56,15.24) v1(36.58,57.07) v1(36.61,54.05) v1(36.58,28.14) v1(36.55,26.37) v1(36.57,10.96) v1(36.66,12.5) v1(37.02,2.25) v1(37.01,0.87) v1(37.75,58.95) v1(38.18,28.16) v1(38.16,26.37) v1(38.35,30.49) v1(38.56,23.06) v1(38.96,57.12) v1(39.14,74.9) v1(39.41,7.23) v1(39.42,2.27) v1(39.45,0.87) v1(39.63,41.74) v1(39.93,8.94) v1(40.16,28.19) v1(40.25,15.44) v1(40.64,76.2) v1(40.64,71.12) v1(40.64,66.04) v1(40.64,35.56) v1(41.22,54.05) v1(41.38,57.05) v1(42.38,1.98) v1(42.57,23.04) v1(42.73,15.43) v1(42.8,74.93) v1(42.78,25.72) v1(43.03,59.02) v1(43.03,12.26) v1(43.8,63.27) v1(44.35,78.61) v1(44.3,74.96) v1(44.55,23.04) v1(44.96,59.05) v1(45.12,11.16) v1(45.35,13.39) v1(45.72,71.12) v1(45.72,40.64) v1(45.72,35.56) v1(45.76,28.15) v1(46.38,68.96) v1(46.42,25.61) v1(46.94,28.15) v1(46.94,23.01) v1(47.14,69.01) v1(47.05,49.56) v1(47.19,64.06) v1(47.36,18.2) v1(47.52,21.69) v1(47.74,2.72) v1(48.15,56.91) v1(48.16,22.99) v1(48.23,13.75) v1(48.53,28.17) v1(49.43,59.11) v1(49.45,2) v1(49.88,11.54) v1(49.9,10.6) v1(49.91,9.87) v1(50.54,4.33) v1(50.83,49.11) v1(50.8,30.48) v1(50.85,10.6) v1(51.39,18.88) v1(51.66,11.49) v1(51.65,10.63) v1(51.66,9.82) v1(52.1,78.66) v1(52.12,62.17) v1(52.85,35.5) v1(52.91,56.82) v1(52.89,42.42) v1(53.6,56.82) v1(53.55,8.16) v1(53.7,72.75) v1(53.7,60.3) v1(55.88,60.96) v1(55.88,50.8) v1(55.88,45.72) v1(55.88,30.48) v1(55.98,74.85) v1(56.08,57.95) v1(56.11,19.9) v1(57.22,10.49) v1(57.46,72.14) v1(57.87,5.24) v1(58.06,72.16) v1(58.91,17.77) v1(58.95,22.29) v1(59.36,20.24) v1(59.72,61.4) v1(60.96,71.12) v1(60.96,55.88) v1(60.96,50.8) v1(60.96,40.64) v1(60.96,35.56) v1(61.49,2.9) v1(61.51,1.81) v1(62.13,3.94) v1(62.79,8.63) v1(62.79,6.26) v1(62.91,14.19) v1(63.54,3.96) v1(65,3.91) v1(65.39,15.56) v1(65.54,1.81) v1(65.57,3.04) v1(65.72,80.54) v1(66.04,60.96) v1(66.04,55.88) v1(66.04,45.72) v1(66.04,40.64) v1(66.04,35.56) v1(66.04,5.08) v1(66.19,63.91) v1(66.98,3.47) v1(67.72,78.23) v1(67.82,75.72) v1(67.77,62.81) v1(67.93,80.38) v1(68.06,71.97) v1(68.7,20.36) v1(69.49,76.96) v1(69.73,8.62) v1(70.17,6.13) v1(70.67,2.97) v1(73.59,4.88) v1(74.27,48.67) v1(74.73,12.72) v1(75.16,53.31) v1(75.36,52.2) v1(76.2,76.2) v1(76.2,71.12) v1(76.2,66.04) v1(76.2,45.72) v1(76.61,51.92) v1(76.88,3.99) v1(77.93,52.12) v1(78,76.91) v1(78.03,63.96) v1(78.07,53.25) v1(78.74,45.21) v1(78.93,18.25) v1(78.85,5.48) v1(78.95,2.58) v1(79.14,82.28) v1(79.1,48.69) v1(79.07,37.31) v1(79.4,30.43) v1(79.41,28.22) v1(79.38,21.46) v1(79.71,75.79) v1(79.73,62.69) v1(79.78,78.21) v1(79.76,65.1) v1(79.76,45.21) v1(79.78,37.31) v1(80.24,30.45) v1(80.25,28.25) v1(80.26,21.44) v1(80.47,37.29)
VBAT: length 19.6
  Top Layer w0.406: U11.14 U11.13
  Top Layer w0.762: U11.13 52.03,12.65 53.51,12.65
  Top Layer w1.016: 53.51,12.65 54.7,12.65 55.59,13.54 58.92,13.54 ; 58.92,13.54 C23.2 ; 58.92,13.54 BATTERY3.7v1.1
VCC_1V8: length 0.4
  Top Layer w0.152: 51.35,27.32 51.75,27.32
VCC_3V3: length 298.3
  Top Layer w0.152: 34.54,29.69 33.64,28.79 33.64,22.14 34.98,20.8 41.71,20.8 42.01,21.11 R42.2 ; 34.54,29.69 30.69,33.55 15.38,33.55 9.77,39.16 9.77,41.81 10.11,42.15 R50.1 ; 34.54,29.69 R41.2 49.19,29.69 v1(50.81,28.07) ; R21.1 75.98,23.22 76.04,23.16 ; v1(77,41.64) 76.9,41.74 R20.1 ; v1(76.99,33.91) 76.96,33.94 R14.1 ; WORK_LED.2 61.13,16.54 62.62,15.04 v1(66.63,15.04) ; 50.55,27.32 50.95,27.32 ; 62.73,72.09 61.77,72.09
  Top Layer w0.305: 50.56,27.32 50.56,27.82 v1(50.81,28.07) ; v1(76.95,23.16) 71.4,23.16 62.81,31.75 62.81,71.05 61.77,72.09 59.81,74.05 59.81,75.65 58.86,76.59 54.72,76.59 52.88,74.75 52.88,71.36 R27.1 ; v1(8.93,4.02) 8.35,4.02 Mic_switch.3
  Top Layer w0.457: C20.2 71.26,20.67 70.49,20.67 63.09,28.07 v1(50.81,28.07) ; C20.2 71.28,19.16 72.21,18.23 v1(72.93,18.23) ; C20.2 71.44,20.5 U12.6
  Bottom Layer w0.152: v1(66.63,15.04) 72.86,15.04 72.98,14.92
  Bottom Layer w0.305: v1(77,41.64) 77,33.92 v1(76.99,33.91) 76.99,23.25
  Bottom Layer w0.457: v1(8.93,4.02) 9.67,4.75 38.01,4.75 41.91,0.85 66.16,0.85 74.9,9.59 74.9,10.98 72.98,12.9 72.98,18.24 77.05,22.3 77.05,23.06
VCC_SD: length 28.6
  Top Layer w0.152: 74.94,2.32 74.94,10.76
  Top Layer w0.457: v1(69.4,10.79) 68.31,10.79 68.25,10.84 66.08,10.84 ; U12.1 75.59,20.44 75.59,11.41 74.96,10.77 73.93,10.77 v1(73.92,10.76) ; 66.08,10.84 66.21,10.72 D19.2 ; 66.08,10.84 C24.2
  Bottom Layer w0.457: v1(69.4,10.79) 73.9,10.79 v1(73.92,10.76)
BTST: length 2.1
  Top Layer w0.254: C18.2 47.54,11.7 48.25,10.99 48.85,10.99 U11.21
CARD_DETECT: length 31.9
  Top Layer w0.152: 66.34,72.9 66.35,72.92 66.35,75.43 64.53,77.25 42,77.25 40.55,78.7 40.55,80.94
CE: length 4.6
  Top Layer w0.152: U11.9 53.73,10.48 55.03,9.18 55.03,8.76 55.35,8.44 R38.1
GPIO0_D0(UART2_RX_M0): length 44.2
  Top Layer w0.152: JP1.51 44.15,26.49 v1(44.23,26.56) ; v1(72.48,52.57) 73.06,52.57 73.12,52.64 R26.1
  Bottom Layer w0.152: v1(72.48,52.57) 68.24,52.57 44.23,28.55 v1(44.23,26.56)
GPIO0_D1(UART2_TX_M0): length 47.4
  Top Layer w0.152: R25.1 73.1,56.15 72.87,55.93 v1(72.48,55.93) ; v1(44.96,26.06) 44.96,24.12 44.96,24.12
  Bottom Layer w0.152: v1(44.96,26.06) 44.95,26.04 44.07,26.04 43.75,26.36 43.75,28.81 70.87,55.93 v1(72.48,55.93)
GPIO3_D1: length 45.9
  Top Layer w0.152: v1(74.66,35.42) 75.91,35.42 75.94,35.45 ; JP1.25 38.96,24.12 38.96,25.15 38.95,25.16 v1(38.87,25.16)
  Top Layer w0.305: 78.27,35.45 75.94,35.45
  Bottom Layer w0.152: v1(38.87,25.16) 38.87,25.19 39.82,26.14 41.25,26.14 42.54,24.85 63.84,24.85 74.4,35.42 v1(74.66,35.42)
GPIO3_D2: length 49.4
  Top Layer w0.152: v1(39.28,26.45) 39.35,26.38 JP1.27 ; v1(74.87,43.15) 74.89,43.17 75.94,43.17
  Top Layer w0.305: SW_VOLUME_UP.3 75.94,43.17
  Bottom Layer w0.152: v1(39.28,26.45) 41.3,26.45 42.64,25.11 56.82,25.11 v1(74.87,43.15)
GPIO3_D4: length 74.4
  Top Layer w0.152: 39.75,27.32 39.75,27.92 39.68,27.99 39.68,28.39 39.75,28.46 39.75,29.13 v1(39.74,29.14) ; v1(57.98,80.54) 57.25,79.81 55.7,79.81 55.55,79.96 55.55,80.94
  Bottom Layer w0.152: v1(57.98,80.54) 63.03,80.54 66.23,77.35 66.23,65.31 39.74,38.82 v1(39.74,29.14)
GPIO3_D5: length 42.7
  Top Layer w0.152: v1(74.59,26.49) 74.62,26.51 75.94,26.51 ; JP1.29 39.75,25.39 v1(39.83,25.47)
  Top Layer w0.305: SW_SLEEP/WAKE.3 75.95,26.52
  Bottom Layer w0.152: v1(74.59,26.49) 74.59,26.5 73.01,28.09 71.29,28.09 67.8,24.59 42.43,24.59 41.15,25.88 40.75,25.88 40.34,25.47 v1(39.83,25.47)
GPIO3_D7: length 74.5
  Top Layer w0.152: 58.08,79.95 57.75,79.95 57.36,79.56 55.29,79.56 ; v1(39.17,28.41) 39.17,28.07 39.35,27.89 39.35,27.32 ; 55.05,80.94 55.05,79.8 55.29,79.56
  Bottom Layer w0.152: 62.11,61.56 65.97,65.43 65.97,77.19 63.29,79.88 v1(58.08,79.88) ; 62.11,61.56 39.17,38.62 v1(39.17,28.41) ; 62.11,61.56 62.12,61.56
HDMI_CEC_PORT: length 41.5
  Top Layer w0.152: JP8.15 8.26,53.45 8.39,53.58 26.19,53.58 27.63,55.02 43.22,55.02 44.19,56 v1(44.19,56.05) ; JP2.51 44.19,58.09 v1(44.19,58.87)
  Bottom Layer w0.152: v1(44.19,56.05) 44.19,58.87 v1(44.19,58.87)
HDMI_TX0_N: length 53.1
  Top Layer w0.152: 8.62,52.65 JP8.11 ; JP2.84 50.55,60.44 v1(50.57,60.42)
  Top Layer w0.254: v1(50.38,51.77) 50.34,51.81 9.46,51.81 8.62,52.65
  Bottom Layer w0.254: v1(50.57,60.42) 50.57,55.16 50.83,54.9 50.83,53.63 50.57,53.38 50.57,51.97 50.38,51.77
HDMI_TX0_P: length 53.1
  Top Layer w0.152: v1(49.91,60.4) 49.89,60.42 50.15,60.68 JP2.82 ; 9.42,51.35 8.54,52.23 8.08,52.23 8.06,52.25 JP8.9
  Top Layer w0.254: 9.42,51.35 49.69,51.35 v1(49.76,51.28)
  Bottom Layer w0.254: v1(49.76,51.28) 49.76,52.14 50.16,52.55 50.16,60.07 50.04,60.2 50.04,60.27 v1(49.91,60.4)
HDMI_TX1_N: length 56.5
  Top Layer w0.152: v1(48.5,59.42) 48.5,59.45 49.34,60.28 49.34,61.24 JP2.78 ; v1(4.29,51.66) 4.67,52.05 JP8.8
  Top Layer w0.254: v1(10.38,58.1) 10.75,58.1 10.8,58.05 11.24,58.05 11.29,58.1 13.12,58.1 13.27,57.95
  Bottom Layer w0.152: v1(4.29,51.66) 3.77,52.18 3.77,54.31 4.48,55.02 4.48,57.7 5.06,58.28 10.21,58.28 v1(10.38,58.1)
  Bottom Layer w0.254: v1(13.27,57.92) 13.48,57.92 15.23,59.67 16.65,59.67 16.91,59.42 18.18,59.42 18.43,59.67 19.7,59.67 19.96,59.42 21.22,59.42 21.48,59.67 48.11,59.67 48.24,59.55 48.38,59.55 v1(48.5,59.42)
HDMI_TX1_P: length 56.4
  Top Layer w0.152: JP8.6 5.14,51.65 4.66,51.17 v1(3.85,51.17) ; v1(48.46,60.08) 48.71,60.08 48.94,60.31 48.94,61.24 JP2.76
  Top Layer w0.254: v1(13.39,58.58) 13.39,58.58 v1(11.02,58.58)
  Bottom Layer w0.152: v1(3.85,51.17) 3.46,51.55 3.46,54.43 4.18,55.15 4.18,57.83 4.93,58.58 v1(11.02,58.58)
  Bottom Layer w0.254: v1(13.39,58.58) 14.88,60.08 v1(48.46,60.08)
HDMI_TX2_N: length 51.7
  Top Layer w0.152: 8.64,50.65 8.64,50.66 8.59,50.71 8.59,50.93 8.07,51.45 JP8.5 ; 9.82,50.33 8.96,50.33 8.64,50.65 ; v1(46.69,58.96) 47.98,60.25 47.98,60.28 48.16,60.46 48.16,61.25 JP2.72
  Top Layer w0.254: 9.82,50.33 46.28,50.33 v1(46.3,50.31)
  Bottom Layer w0.254: v1(46.69,58.96) 46.18,58.45 46.18,57.03 46.43,56.78 46.43,55.51 46.18,55.25 46.18,53.98 46.43,53.73 46.43,52.46 46.18,52.2 46.18,50.44 v1(46.3,50.31)
HDMI_TX2_P: length 51.8
  Top Layer w0.152: v1(45.78,58.95) 46.26,59.44 46.31,59.44 47.78,60.9 47.78,61.23 JP2.70 ; 9.65,49.96 8.53,49.96 8.09,50.4 8.09,50.84 7.96,50.98 7.51,50.98 JP8.3
  Top Layer w0.254: v1(45.75,49.61) 45.44,49.93 9.68,49.93 9.65,49.96
  Bottom Layer w0.254: v1(45.78,58.95) 45.64,58.82 45.64,50.04 45.77,49.92 45.77,49.63 v1(45.75,49.61)
HDMI_TX_HPD_PORT: length 47.4
  Top Layer w0.152: v1(44.58,48.93) 8.83,48.93 7.49,50.27 7.49,50.61 JP8.1 ; JP2.53 44.55,57.26 44.78,57.04 v1(44.78,55.44)
  Bottom Layer w0.152: v1(44.78,55.44) 44.58,55.24 v1(44.58,48.93)
HDMI_TXCLK_N: length 57.5
  Top Layer w0.152: JP2.90 51.76,61.24 51.76,59.75 v1(51.96,59.55) ; JP8.14 4.82,53.25 v1(4.65,53.41)
  Top Layer w0.254: v1(51.95,53.79) 51.73,53.56 51.01,53.56 50.55,53.1 v1(10.95,53.1)
  Bottom Layer w0.152: v1(10.95,53.1) 10.13,53.1 9.93,53.3 9.53,53.3 9.33,53.1 5.38,53.1 5.27,53.21 4.85,53.21 v1(4.65,53.41)
  Bottom Layer w0.254: v1(51.96,59.55) 51.96,59.55 51.95,59.54 51.95,58.94 52.21,58.69 52.21,57.42 51.95,57.16 51.95,55.89 52.21,55.64 52.21,54.37 51.95,54.11 v1(51.95,53.79)
HDMI_TXCLK_P: length 57.5
  Top Layer w0.152: JP2.88 51.38,61.23 51.38,60.32 51.39,60.31 51.39,59.86 51.27,59.74 v1(51.27,59.53) ; v1(4.32,52.81) 5.51,52.81 5.56,52.86 6.21,52.86 JP8.12
  Top Layer w0.254: v1(51.23,53.03) 50.89,52.69 11.34,52.69 11.19,52.54 v1(10.58,52.54)
  Bottom Layer w0.152: v1(4.32,52.81) 5.24,52.81 5.26,52.8 9.46,52.8 9.48,52.81 9.53,52.81 9.54,52.82 9.94,52.82 9.97,52.8 10.32,52.8 v1(10.58,52.54)
  Bottom Layer w0.254: v1(51.27,59.53) 51.3,59.5 51.3,59.28 51.23,59.2 v1(51.23,53.03)
HDMI_TXDDC_SCL_PORT: length 51.1
  Top Layer w0.152: JP2.100 53.75,61.51 53.75,61.51 v1(53.75,61.93) ; v1(32.65,61.47) 25.62,54.44 13.57,54.44 13.56,54.43 13.16,54.43 13.15,54.44 9.76,54.44 9.66,54.55 9.26,54.55 9.15,54.44 9.12,54.44 8.84,54.17 8.21,54.17 7.89,53.85 JP8.17
  Bottom Layer w0.152: v1(32.65,61.47) 33.97,62.79 52.89,62.79 v1(53.75,61.93)
HDMI_TXDDC_SDA_PORT: length 55.4
  Top Layer w0.152: v1(5.29,54.37) 5.61,54.05 JP8.18 ; v1(53.75,58.96) 53.75,58.06 JP2.99 ; v1(9.46,54.07) 25.92,54.07 v1(32.59,60.74)
  Bottom Layer w0.152: v1(32.59,60.74) 34.25,62.4 50.31,62.4 v1(53.75,58.96) ; v1(5.29,54.37) 5.59,54.07 v1(9.46,54.07)
HP_DET_L: length 38.4
  Top Layer w0.254: 12.15,42.1 12.17,42.08 JP3.15 ; 12.15,42.1 C21.2 12.15,40.15 v1(12.11,40.11) ; 12.15,42.1 R50.2 ; v1(13.82,19.45) 13.79,19.41 R55.1 ; 4.7,27.56 5.68,27.56 v1(5.68,27.56)
  Bottom Layer w0.254: v1(13.82,19.45) 12.11,21.16 12.11,31.28 ; v1(12.11,40.11) 12.11,31.28 ; 12.11,31.28 8.4,27.56 v1(5.68,27.56)
HP_SNS: length 42.6
  Top Layer w0.152: v1(20.99,42.83) 20.31,42.83 19.46,43.68 JP3.8
  Top Layer w0.254: R3.2 5.81,18.24 5.8,18.25 5.8,21.15 7.44,22.79 15.71,22.79 v1(16.01,22.49)
  Bottom Layer w0.152: v1(16.01,22.49) 18.67,25.15 18.67,39.28 20.99,41.59 v1(20.99,42.83)
HPL_OUT: length 34.8
  Top Layer w0.254: v1(20.36,43.91) 20.21,44.06 18.01,44.06 ; R2.2 12.91,26.12 10.71,26.12 9.88,25.29 9.88,25.05 ; 9.88,25.05 9,25.05 ; 9.88,25.05 10.87,24.05 15.46,24.05 17.15,25.75 17.15,28 v1(17.22,28.08)
  Bottom Layer w0.254: v1(17.22,28.08) 17.41,28.27 17.41,28.4 17.82,28.81 17.82,39.43 20.1,41.72 20.1,43.65 v1(20.36,43.91)
HPR_OUT: length 41.6
  Top Layer w0.254: v1(17.94,28.18) 17.94,21.43 16.67,20.16 9.02,20.16 8.7,19.84 8.7,18.25 ; JP3.4 18.22,44.5 18.89,44.5 18.9,44.51 18.93,44.51 18.94,44.49 19.7,44.49 19.75,44.44 20.76,44.44 v1(20.81,44.39)
  Top Layer w0.508: 8.7,18.25 8.74,18.21 R1.2
  Bottom Layer w0.254: v1(17.94,28.18) 18.27,28.51 18.27,39.28 18.37,39.38 18.37,39.4 20.46,41.49 20.46,43.05 20.89,43.48 20.89,44.31 v1(20.81,44.39)
ILIM: length 4
  Top Layer w0.152: R33.2 55.39,9.78 54.2,10.98 U11.10
LED1#: length 11.5
  Top Layer w0.152: R43.1 61.75,78.29 60.98,77.52 55.43,77.52 54.55,78.41 54.55,80.94
MIC1_IN: length 61.2
  Top Layer w0.254: v1(19.54,42.61) 19.54,43 19.28,43.26 18.22,43.26 JP3.10 ; v1(3.73,10.02) 4.73,11.02 4.73,15.18 4.28,15.63 4.28,17.96 3.99,18.25 2.9,18.25 ; v1(16.36,29.22) 16.36,25.83 15.57,25.05 v1(11.42,25.05)
  Top Layer w0.508: R9.1 R4.1 5.45,8.3 3.56,10.19 MIC_INPUT.1
  Bottom Layer w0.254: v1(19.54,42.61) 19.54,42.03 17.11,39.6 17.11,29.97 v1(16.36,29.22) ; v1(11.42,25.05) 11.42,17.71 v1(3.73,10.02)
MIC2_IN: length 6.9
  Top Layer w0.152: MIC2.1 20.82,40.55 19,42.37 19,42.83 18.95,42.88 JP3.12
MIPI_CSI_RX_D2N: length 3.7
  Top Layer w0.152: JP2.33 40.55,59.11 39.35,60.31 JP2.28
MIPI_CSI_RX_D2P: length 3.7
  Top Layer w0.152: JP2.30 39.75,60.34 40.95,59.14 JP2.35
MIPI_CSI_RX_D3N: length 3.7
  Top Layer w0.152: JP2.39 41.74,58.07 41.74,59.17 40.55,60.36 JP2.34
MIPI_CSI_RX_D3P: length 3.7
  Top Layer w0.152: JP2.36 40.95,60.5 42.11,59.35 42.11,59.35 42.15,59.3 JP2.41
OTG: length 5.3
  Top Layer w0.152: U11.8 53.75,9.98 53.94,9.78 53.94,8.67 55.47,7.14 R37.2
PMIC_PWRON: length 2.9
  Top Layer w0.152: JP1.99 53.75,21.2 53.77,21.19
REGN: length 10.8
  Top Layer w0.152: v1(55.35,12.01) 55.79,12.01 R34.2
  Top Layer w0.254: C15.2 47.17,10.43 v1(47.96,10.43) 48,10.48 U11.22
  Bottom Layer w0.152: v1(55.35,12.01) 50.1,12.01 50.08,12.02 49.68,12.02 49.66,12.01 49.53,12.01 v1(47.96,10.43)
SARADC_VIN1: length 57.5
  Top Layer w0.152: v1(5.47,5.09) 5.47,5.81 R4.2 5.42,5.86 4.06,5.86 4.05,5.85 C5.2 ; v1(47.75,28.22) 47.75,28.21 47.75,27.32
  Bottom Layer w0.152: v1(47.75,28.22) 45.44,25.91 45.44,25.86 45.16,25.58 44.12,25.58 42.77,26.93 35.56,26.93 13.92,5.29 5.67,5.29 v1(5.47,5.09)
SCL: length 26.7
  Top Layer w0.152: U11.5 51.52,8.46 51.69,8.29 51.69,8.26 v1(51.93,8.03) ; JP1.35 40.95,24.11 40.95,23.5 41.11,23.34 v1(41.11,22.67) 41.15,22.63 R42.1
  Bottom Layer w0.152: v1(41.11,22.67) 41.11,12.55 42.95,10.71 42.95,10.09 43.98,9.06 50.92,9.06 51.93,8.05 v1(51.93,8.03)
SDA: length 29.5
  Top Layer w0.152: v1(40.95,25.4) 40.95,27.31 40.95,27.32 40.95,28.27 40.95,28.28 40.95,28.43 41.05,28.52 R41.1 ; v1(52.54,8.83) 52.53,8.81 U11.6
  Bottom Layer w0.152: v1(40.95,25.4) 41.82,24.53 41.82,12.47 44.98,9.31 51.03,9.31 51.08,9.26 52.11,9.26 v1(52.54,8.83)
SDMMC0_CLK: length 46
  Top Layer w0.152: D16.1 66.75,8.7 67.03,8.97 67.03,9.5 67.27,9.74 68.25,9.74 68.28,9.72 v1(69.49,9.72) ; JP1.57 45.35,25.23 46.22,26.09 46.62,26.09 46.84,25.87 62.93,25.87 66.5,22.3 66.5,17.61 68.28,15.83 69.76,15.83 71.67,13.92 v1(71.67,9.73)
  Bottom Layer w0.152: v1(69.49,9.72) 69.5,9.73 v1(71.67,9.73)
SDMMC0_CMD: length 42.7
  Top Layer w0.152: 46.15,27.32 46.15,26.54 46.35,26.34 46.76,26.34 46.98,26.12 63.04,26.12 66.75,22.41 66.75,17.77 68.44,16.08 69.87,16.08 71.92,14.03 71.92,12.09 v1(72.15,11.87) ; 66.24,12 68.19,12 68.25,11.94 69.39,11.94 v1(69.45,11.89)
  Bottom Layer w0.152: v1(72.15,11.87) 69.47,11.87 v1(69.45,11.89)
SDMMC0_D0: length 43.8
  Top Layer w0.152: v1(69.53,7.54) 68.25,7.54 ; JP1.63 46.55,24.6 47.27,25.31 62.77,25.31 65.99,22.09 65.99,17.38 68.06,15.32 69.55,15.32 70.71,14.17 70.71,7.77 v1(70.93,7.54) ; 66.17,7.51 68.22,7.51 68.25,7.54
  Bottom Layer w0.152: v1(70.93,7.54) 69.53,7.54 v1(69.53,7.54)
SDMMC0_D1: length 42.6
  Top Layer w0.152: JP1.67 47.31,24.16 47.31,24.38 47.43,24.5 47.43,24.56 47.5,24.64 47.5,24.65 47.91,25.06 62.66,25.06 65.74,21.99 65.74,17.28 67.95,15.06 69.45,15.06 70.41,14.1 70.41,7.16 69.56,6.32 68.37,6.32 68.25,6.44 68.24,6.43 66.17,6.43
SDMMC0_D2: length 30.4
  Top Layer w0.152: D13.1 66.24,14.14 68.25,14.14 68.25,14.29 65.48,17.06 65.48,21.88 62.57,24.79 51.26,24.79 51.24,24.81 49.47,24.81 49.45,24.79 48,24.79 47.75,24.54 JP1.69
SDMMC0_D3: length 39.4
  Top Layer w0.152: JP1.61 46.15,24.56 47.16,25.57 62.87,25.57 66.24,22.19 66.24,17.49 68.16,15.57 69.66,15.57 70.96,14.27 70.96,13.3 v1(71.19,13.07) ; 66.24,12.96 68.16,12.96 68.25,13.04 68.27,13.06 v1(69.41,13.06)
  Bottom Layer w0.152: v1(69.41,13.06) 69.42,13.07 v1(71.19,13.07)
SDMMC0_DET: length 45.8
  Top Layer w0.152: 48.95,27.32 48.95,26.55 49.13,26.38 63.14,26.38 67.05,22.46 67.05,17.83 68.5,16.38 68.89,16.38 68.94,16.33 69.97,16.33 72.18,14.13 72.18,13.1 72.69,12.58 72.69,9.14 71.89,8.34 71.89,6.89 72.81,5.97 R52.1 72.82,2.32 R51.1
SPEAKER+: length 6
  Top Layer w0.305: SPEAKER.1 1.57,34 6.28,34 6.66,34.38 U1.8
SPEAKER-: length 12.1
  Top Layer w0.305: R11.1 10.18,33.55 8.93,33.55 8.61,33.86 ; SPEAKER.2 3.49,29.43 7.6,33.53 8.28,33.53 8.61,33.86 ; 8.61,33.86 U1.5
SPK_OUT: length 4.2
  Top Layer w0.508: 8.71,27.73 7.49,27.73 6.77,27.01 6.77,25.08 6.8,25.05
STATUS: length 11.9
  Top Layer w0.152: U11.4 51.02,8.28 v1(51.21,8.09) ; CHRG.1 42.23,10.45 v1(42.37,10.31)
  Bottom Layer w0.152: v1(51.21,8.09) 50.5,8.81 43.88,8.81 v1(42.37,10.31)
SW: length 7.2
  Top Layer w0.254: 46.59,13.31 45.97,12.69 C18.1 ; U11.20 U11.19
  Top Layer w0.61: 46.59,13.7 L1.1
  Top Layer w0.762: 46.59,13.7 46.59,13.44 47.35,12.67 47.89,12.67 48.59,11.98 U11.19
SYS: length 93.8
  Top Layer w0.152: v1(57.7,7.19) 57.65,7.14 57.02,7.14
  Top Layer w0.254: U11.16 U11.15
  Top Layer w0.762: 50.77,12.64 50.77,15.22 L1.2
  Top Layer w1.016: 71.56,27.41 71.56,78.03 ; 71.58,27.03 v1(71.58,26.45) v1(71.58,25.45) 71.58,24.74 71.6,24.71 v1(71.6,24.41)
  Bottom Layer w0.152: 57.65,14.26 57.7,14.21 v1(57.7,7.19)
  Bottom Layer w1.016: 66.54,16.82 66.58,16.87 69.47,16.87 71.56,18.96 71.56,25.55 71.58,25.56 v1(71.58,26.45) v1(71.58,27.41) ; 52.24,14.26 59.22,14.26 61.75,16.79 66.27,16.79
  vias: v1(52.51,14.12) v1(53.37,14.13) v1(54.23,14.12)
TS: length 5.6
  Top Layer w0.152: U11.11 55.13,11.48 55.54,11.07 R35.2 ; 57,12.35 57,11.84 56.89,11.73 56.25,11.73 56.15,11.62 56.15,11.07
USB2_0_OTG_DM: length 49
  Top Layer w0.203: v1(34.24,57.06) 34.24,57.09 34.56,57.41 34.56,57.61 34.55,57.61 JP2.3
  Top Layer w0.508: USB2.2 30.74,13.51 D10.2 30.81,13.59 30.81,13.94 31.28,14.4 v1(31.28,25.56)
  Bottom Layer w0.508: 31.28,25.57 31.28,28.89 34.36,31.98 34.36,55.73 33.99,56.1 33.99,56.82 34.24,57.06
USB2_0_OTG_DP: length 48.9
  Top Layer w0.203: v1(35.15,57.08) 34.95,57.28 JP2.5
  Top Layer w0.508: USB2.3 32.8,10.99 D11.2 32.8,14.19 31.94,15.05 v1(31.94,25.56)
  Bottom Layer w0.508: v1(35.15,57.08) 35.15,56.32 35.02,56.2 35.02,31.71 31.94,28.62 v1(31.94,25.56)
USB2_HOST2_N: length 39.6
  Top Layer w0.152: v1(14.5,43.59) 14.8,43.29 15.55,43.29 JP3.9
  Top Layer w0.305: 8.33,76.97 8.33,77.87
  Top Layer w0.508: 8.33,76.97 8.33,76.25 7.39,75.31 7.39,74.4 7.42,74.4 v1(7.68,74.13)
  Bottom Layer w0.508: v1(14.5,43.59) 14.49,43.57 13.14,43.57 11.68,45.04 11.68,70.07 7.68,74.06 v1(7.68,74.13)
USB2_HOST2_P: length 39.6
  Top Layer w0.152: JP3.11 14.48,42.88
  Top Layer w0.508: v1(7.34,76.38) 7.33,76.39 JP6.3 ; 14.48,42.88 13.58,42.88 12.34,44.11 v1(12.34,45.95)
  Bottom Layer w0.508: v1(7.34,76.38) 7.34,75.41 v1(8.15,74.6) 12.34,70.41 v1(12.34,45.95)
USB2_HOST3_N: length 65.6
  Top Layer w0.152: 54.58,71.88 54.8,72.09 JP7.9 ; 17.27,46.29 17.27,45.86 16.66,45.25 16.66,44.69 16.45,44.48 JP3.3
  Top Layer w0.508: 17.27,46.29 17.63,46.65 50.47,46.65 54.54,50.72 54.54,66.48 53.68,67.34 53.68,67.82 54.54,68.68 54.54,71.86 54.56,71.88 54.58,71.88
USB2_HOST3_P: length 65.5
  Top Layer w0.152: JP3.5 16.54,44.08 16.92,44.45 16.92,45.15 17.76,45.99 ; JP7.7 55.3,72.06
  Top Layer w0.508: 17.92,45.99 50.77,45.99 55.22,50.44 55.22,71.24 55.3,71.32 55.3,72.06
USIM_CLK: length 34.8
  Top Layer w0.152: D5.6 48.1,65.51 v1(49.03,65.51) ; v1(63.43,65.6) CARD1.C3 ; v1(49.03,79.77) 49.03,80.8 49.11,80.88 49.05,80.94
  Bottom Layer w0.152: D5.6 48.16,65.6 49.03,65.6 ; 49.03,65.6 49.03,65.52 49.04,65.52 ; 49.03,65.6 v1(49.03,79.77) ; 49.03,65.6 v1(63.43,65.6)
USIM_DATA: length 39.7
  Top Layer w0.152: 48.55,80.94 48.55,80.94 v1(48.55,79.3) ; CARD1.C7 66.32,66.8 v1(65.26,66.8) ; 46.09,65.73 46.2,65.62 v1(46.2,64.57)
  Bottom Layer w0.152: v1(65.26,66.8) 65.26,66.76 63.2,64.7 46.33,64.7 v1(46.2,64.57) 46.2,66.25 48.55,68.6 v1(48.55,79.3)
USIM_RST: length 35.1
  Top Layer w0.152: v1(49.51,67.13) 49.45,67.07 46.42,67.07 46.16,67.32 46.16,67.79 D5.3 ; CARD1.C2 65.37,68.14 v1(65.31,68.08) ; v1(49.51,79.31) 49.51,80.32 49.55,80.36 49.55,80.94
  Bottom Layer w0.152: v1(49.51,79.31) v1(49.51,67.13) 64.35,67.13 64.42,67.2 ; v1(65.31,68.08) 64.42,67.2
USIM_VDD: length 32.2
  Top Layer w0.152: CARD1.C1 66.39,70.68 v1(65.24,70.68) ; 48.05,80.94 48.05,79.77 v1(48.03,79.76) ; v1(50.24,68.82) 48.07,68.82 v1(48.07,68.82) 48.09,68.8 D5.1
  Bottom Layer w0.152: v1(48.03,79.76) 48.07,79.73 v1(48.07,68.82) ; v1(65.24,70.68) 63.38,68.82 v1(50.24,68.82)
V_USB: length 10.4
  Top Layer w0.406: D1.2 41.49,7.22 C17.2 ; 48.68,8.65 48.84,8.81 U11.1
  Top Layer w0.61: C17.2 43.7,7.22 F1.2 44.97,8.49 48.52,8.49 48.68,8.65
$1N4419: length 3.6
  Top Layer w0.508: JP4.3 75.25,58.34 74.98,58.6 R25.2
$1N4460: length 3.8
  Top Layer w0.508: JP4.2 75.11,55.8 74.27,54.96 R26.2
$1N10023: length 9.2
  Top Layer w0.152: v1(60.32,23.74) R53.2 ; JP1.95 52.95,23.45 v1(52.86,23.36)
  Bottom Layer w0.152: v1(60.32,23.74) 59.94,23.36 v1(52.86,23.36)
$1N11178: length 1.5
  Top Layer w0.152: R53.1 62.07,23.67 Q1.1
$1N11221: length 2.9
  Top Layer w0.152: 62.21,18.35 63.14,18.35 63.62,18.82 R46.2
$1N11225: length 3.1
  Top Layer w0.152: R46.1 63.1,21.6 61.75,20.25 Q1.3
$2N2: length 77.8
  Top Layer w0.152: Camera_Switch.2 18.67,4 CAMERA_ON.1 18.67,7.21 v1(16.7,9.17) ; JP6.1 9.33,70.33 15.11,64.55 v1(15.11,54.97)
  Bottom Layer w0.152: v1(16.7,9.17) 15.11,10.76 v1(15.11,54.97)
$2N7: length 2.6
  Top Layer w0.152: 7.31,28.9 U1.2 U1.3
$2N10: length 4.9
  Top Layer w0.152: U1.4 8.61,32 9.16,32.55 10.31,32.55
  Top Layer w0.508: R10.2 8.61,29.13 U1.4
$2N12: length 3.2
  Top Layer w0.152: 6.83,5.83 6.94,5.83 7.77,6.67 R8.1
  Top Layer w0.508: C1.2 8.24,6.78 R8.1
$2N528: length 1.4
  Top Layer w0.508: R10.1 9.57,28.36 9.8,28.12 C2.2
$2N1557: length 4.1
  Top Layer w0.152: R8.2 8.14,5.31 Mic_switch.2
  Top Layer w0.508: C22.2 9.46,5.8 R8.2
$2N21313: length 3.1
  Top Layer w0.254: R55.2 12.92,17.69 12.36,18.25 10.9,18.25
$2N21397: length 2.5
  Top Layer w0.254: 3.9,25.05 3.84,25.11 R56.2
$3N6118: length 4.1
  Top Layer w0.152: 51.3,71.3 51.28,71.29 49.39,71.29 RING_IND1.1 ; 51.3,71.3 JP7.23 ; 51.3,71.3 R27.2
$3N9431: length 3.2
  Top Layer w0.152: R43.2 62.73,76.19 SIM_STATUS.1
$3N12580: length 45.6
  Top Layer w0.254: v1(39.36,82.13) 39.52,81.97 39.55,81.97 ; 39.55,80.94 39.55,81.96
  Top Layer w0.305: 56.05,80.94 56.5,80.94 ; 39.55,80.94 38.55,80.94
  Top Layer w0.508: 38.55,80.94 38.74,81.13 v1(38.74,82.02)
  Top Layer w1.016: 56.5,80.94 56.69,80.75 ; 67.76,81.84 60.75,81.84 60.73,81.86 v1(60.14,81.86) 57.78,81.86 ; 56.36,81.66 56.58,81.88 57.57,81.87 ; 68,81.67 69.1,81.67 C28.2 70.52,81.66 71.39,80.78 C25.1 73.43,80.76 L2.2
  Bottom Layer w1.016: 60.11,81.84 v1(59.15,81.84) v1(58.13,81.84) 38.91,81.84 v1(38.74,82.02)
$5N13102: length 10.3
  Top Layer w0.254: JP8.19 8.03,54.84 8.03,56.27 4.38,59.93 D8.1
$6N34185: length 1.3
  Top Layer w0.152: R36.1 41.24,11.69 CHRG.2
$6N34537: length 0.5
  Top Layer w0.152: U11.2 U11.3
$6N55425: length 16
  Top Layer w0.406: USB1.11 52.69,7.98 v1(52.74,8.02) ; 47.4,4.34 48.1,5.05 48.1,6.16 48.06,6.2 48.06,6.21 47.89,6.38 USB1.2
  Top Layer w0.61: 48.1,5.05 48.1,4.86 v1(47.61,4.36) ; 47.4,4.34 v1(46.96,4.34) F1.1
  Bottom Layer w0.406: v1(52.74,8.02) 52.54,7.83 52.54,7.78 52.18,7.42 52.13,7.42 49.07,4.36 v1(47.61,4.36) 46.96,4.36
$6N55448: length 7.8
  Top Layer w0.152: USB1.4 49.04,5.02 47.33,3.31 45.62,3.31 45,2.69 R32.2
$6N55522: length 6.2
  Top Layer w0.152: R31.2 55.1,4.82 52.83,4.82 52.04,5.61 USB1.10
$9N699: length 6.4
  Top Layer w0.152: 68.25,5.34 71.48,5.34 71.94,4.88 R52.2
$9N2922: length 1.3
  Top Layer w0.152: U12.5 73.55,21.19 73.11,21.19 73.04,21.25 73.04,21.49 72.94,21.6 72.58,21.6

## Copper pours and planes (outline as drawn; the poured copper is in the pictures)
GND on Top Layer: -0.38,83.87 -0.38,0.23 -0.38,0.22 81.31,0.22 81.44,0.36 81.44,83.92 81.36,84 -0.25,84
GND on Bottom Layer: 0.26,83.11 0.26,-0.53 0.27,-0.53 81.95,-0.53 82.08,-0.4 82.08,83.16 82,83.24 0.39,83.24
SYS on Top Layer: 55.91,16.82 56.16,16.56 56.16,14.83 54.98,13.66 49.1,13.66 48.92,13.84 48.92,16.73 49.01,16.82

## Text on the board
Bottom Silkscreen Layer: Thank you KM,ER,CZ,FP,PC,PM,BP,BS,AF,AR<3,WN | OURphone v1.2
Top Silkscreen Layer: OFF | ON | M2_MODEM | HEADPHONE | UART_DEBUG | USB_WEBCAM | HDMI | + | TX | RX | - | Orange Pi CM4 | motherboard - receiving part
